# Altium schematic sheet [5]-POWER.SchDoc
size A4
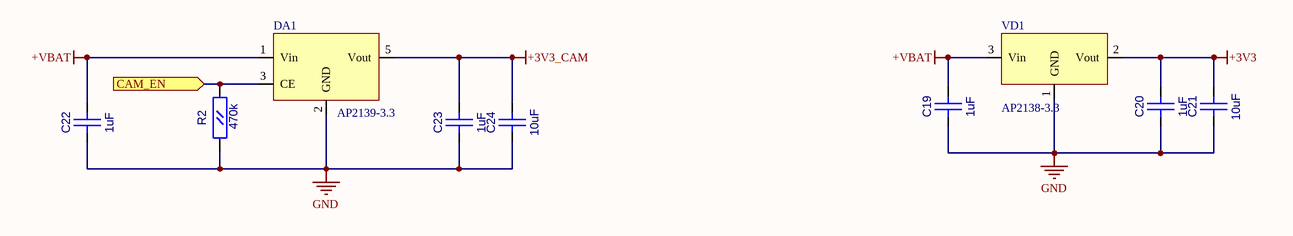
[diagram p0: [5]-POWER.SchDoc]

## Parts
C19  1uF  [CC0603]
C20  1uF  [CC0603]
C21  10uF  [CC0805]
C22  1uF  [CC0603]
C23  1uF  [CC0603]
C24  10uF  [CC0805]
DA1  AP2139-3.3  [SOT23-5]
R2  470k  [RC0603]
VD1  AP2138-3.3  [SOT-23(123)]

## Ports
CAM_EN (in)

## Nets
+3V3: C20.2(B) C21.2(B) VD1.2(Vout)
+3V3_CAM: C23.2(B) C24.2(B) DA1.5(Vout)
+VBAT: C19.2(B) C22.2(B) DA1.1(Vin) VD1.3(Vin)
GND: C19.1(A) C20.1(A) C21.1(A) C22.1(A) C23.1(A) C24.1(A) DA1.2(GND) R2.1(A) VD1.1(GND)
CAM_EN: DA1.3(CE) R2.2(B) ; port CAM_EN

## Library data of the parts
C19 C20 C22 C23 = CC0603: Value: 1uF
C21 C24 = CC0805: Value: 10uF
DA1 = AP2139: Value: AP2139-3.3
R2 = RC0603: Value: 470k
VD1 = AP2138: Value: AP2138-3.3